# Altium schematic sheet main.SchDoc
size A4
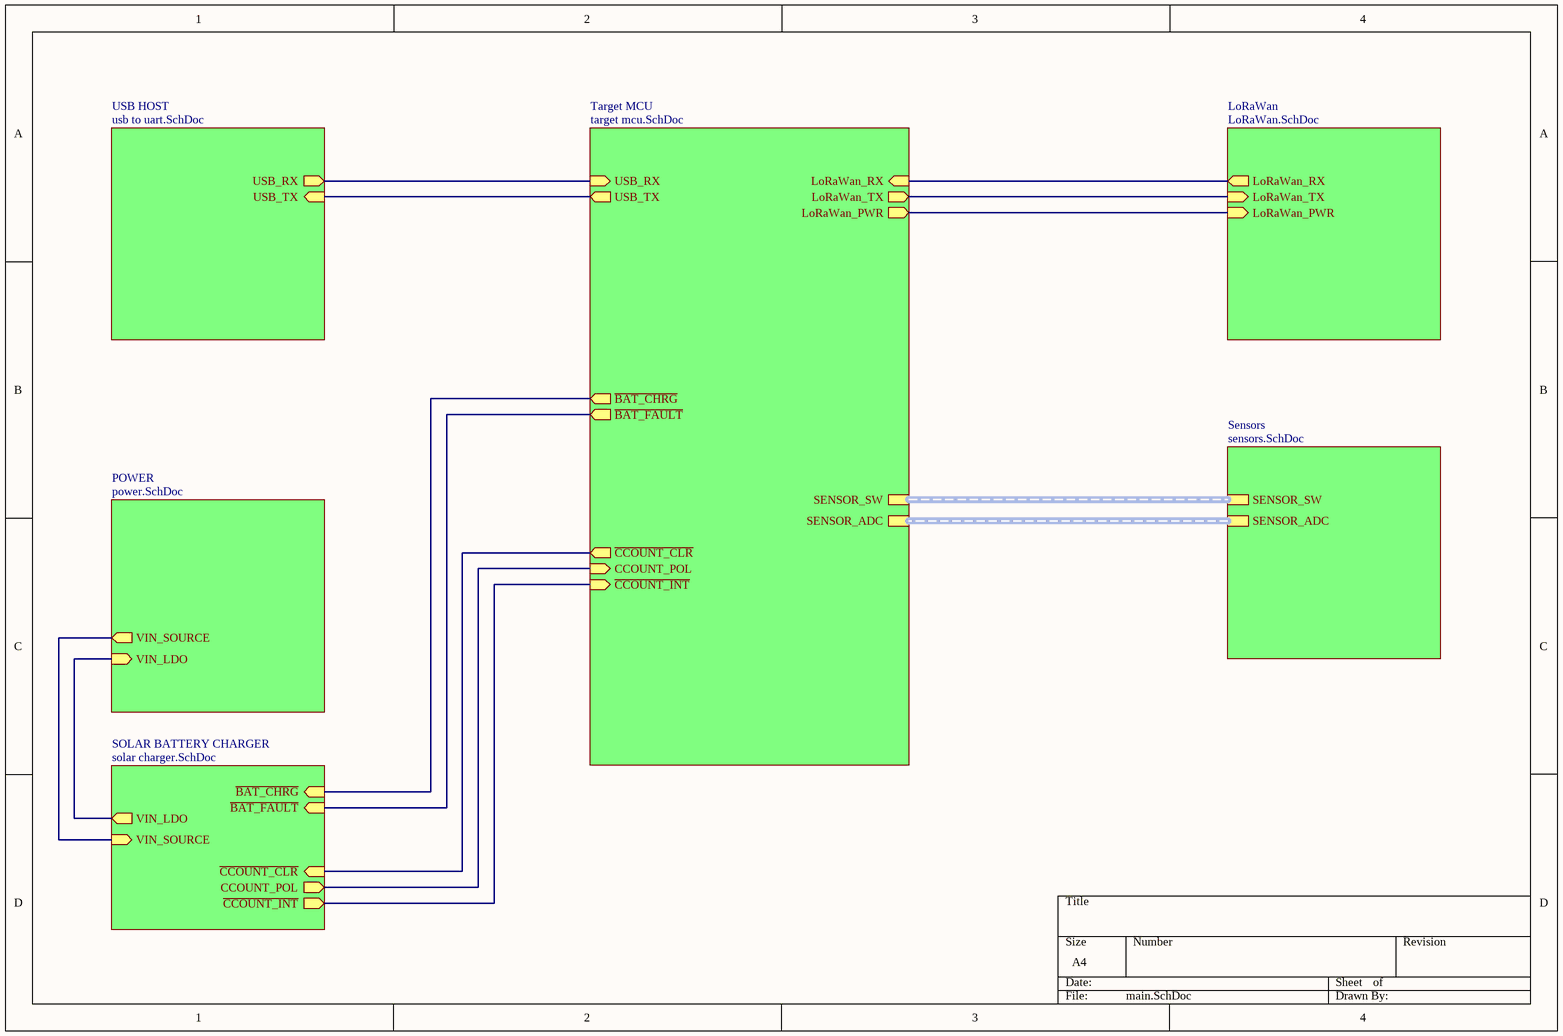
[diagram p0: main.SchDoc]

## Sub-sheets
LoRaWan = LoRaWan.SchDoc: LoRaWan_TX (in), LoRaWan_RX (out), LoRaWan_PWR (in)
POWER = power.SchDoc: VIN_SOURCE (out), VIN_LDO (in)
Sensors = sensors.SchDoc: SENSOR_ADC (harness SENSOR ADC), SENSOR_SW (harness SENSOR SWITCH)
SOLAR BATTERY CHARGER = solar charger.SchDoc: ~{CCOUNT_CLR} (in), ~{CCOUNT_INT} (out), VIN_SOURCE (in), VIN_LDO (out), ~{BAT_CHRG} (in), CCOUNT_POL (out), ~{BAT_FAULT} (in)
Target MCU = target mcu.SchDoc: SENSOR_SW (harness SENSOR SWITCH), LoRaWan_RX (in), SENSOR_ADC (harness SENSOR ADC), USB_TX (out), LoRaWan_TX (out), USB_RX (in), LoRaWan_PWR (out), ~{CCOUNT_CLR} (out), CCOUNT_POL (in), ~{CCOUNT_INT} (in), ~{BAT_CHRG} (out), ~{BAT_FAULT} (out)
USB HOST = usb to uart.SchDoc: USB_RX (out), USB_TX (in)

## Nets
(unnamed): sheet Target MCU/LoRaWan_RX, sheet LoRaWan/LoRaWan_RX
(unnamed): sheet Target MCU/USB_TX, sheet USB HOST/USB_TX
(unnamed): sheet Target MCU/LoRaWan_TX, sheet LoRaWan/LoRaWan_TX
(unnamed): sheet Target MCU/USB_RX, sheet USB HOST/USB_RX
(unnamed): sheet Target MCU/LoRaWan_PWR, sheet LoRaWan/LoRaWan_PWR
(unnamed): sheet Target MCU/~{CCOUNT_CLR}, sheet SOLAR BATTERY CHARGER/~{CCOUNT_CLR}
(unnamed): sheet Target MCU/CCOUNT_POL, sheet SOLAR BATTERY CHARGER/CCOUNT_POL
(unnamed): sheet Target MCU/~{CCOUNT_INT}, sheet SOLAR BATTERY CHARGER/~{CCOUNT_INT}
(unnamed): sheet Target MCU/~{BAT_CHRG}, sheet SOLAR BATTERY CHARGER/~{BAT_CHRG}
(unnamed): sheet Target MCU/~{BAT_FAULT}, sheet SOLAR BATTERY CHARGER/~{BAT_FAULT}
(unnamed): sheet POWER/VIN_SOURCE, sheet SOLAR BATTERY CHARGER/VIN_SOURCE
(unnamed): sheet POWER/VIN_LDO, sheet SOLAR BATTERY CHARGER/VIN_LDO

## Buses and harness runs
harness sheet Sensors/SENSOR_ADC = sheet Target MCU/SENSOR_ADC
harness sheet Sensors/SENSOR_SW = sheet Target MCU/SENSOR_SW